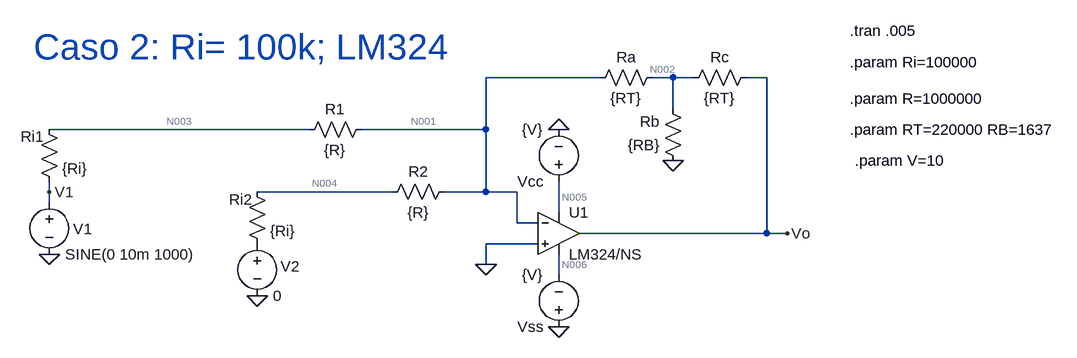
[diagram p0: schematic Caso 1.2 - LM324.asc]
Caso 1.2 - LM324.asc, the LTspice schematic file:
Version 4
SHEET 1 1568 1072
WIRE 560 352 384 352
WIRE 672 352 640 352
WIRE 704 352 672 352
WIRE 816 352 784 352
WIRE 672 400 672 352
WIRE 112 432 -288 432
WIRE 384 432 384 352
WIRE 384 432 192 432
WIRE -288 528 -288 512
WIRE 240 528 32 528
WIRE 384 528 384 432
WIRE 384 528 320 528
WIRE 432 528 384 528
WIRE -288 544 -288 528
WIRE 496 560 496 512
WIRE 432 576 432 528
WIRE 464 576 432 576
WIRE 816 592 816 352
WIRE 816 592 528 592
WIRE 848 592 816 592
WIRE 464 608 384 608
WIRE 384 640 384 608
WIRE 496 656 496 624
FLAG -288 624 0
FLAG 32 688 0
FLAG 384 640 0
FLAG 848 592 Vo
FLAG 496 432 0
FLAG 496 736 0
FLAG 672 480 0
FLAG -288 528 V1
SYMBOL res 208 416 R90
WINDOW 0 0 56 VBottom 2
WINDOW 3 32 56 VTop 2
SYMATTR InstName R1
SYMATTR Value {R}
SYMBOL res 336 512 R90
WINDOW 0 0 56 VBottom 2
WINDOW 3 32 56 VTop 2
SYMATTR InstName R2
SYMATTR Value {R}
SYMBOL voltage -288 528 R0
WINDOW 0 37 57 Left 2
WINDOW 123 0 0 Left 0
WINDOW 39 0 0 Left 0
SYMATTR InstName V1
SYMATTR Value SINE(0 10m 1000)
SYMBOL voltage 32 592 R0
WINDOW 0 36 51 Left 2
WINDOW 123 0 0 Left 0
WINDOW 39 0 0 Left 0
SYMATTR InstName V2
SYMATTR Value 0
SYMBOL voltage 496 752 R180
WINDOW 123 0 0 Left 0
WINDOW 39 0 0 Left 0
SYMATTR InstName Vss
SYMATTR Value {V}
SYMBOL voltage 496 528 R180
WINDOW 123 0 0 Left 0
WINDOW 39 0 0 Left 0
SYMATTR InstName Vcc
SYMATTR Value {V}
SYMBOL res -304 416 R0
WINDOW 0 -28 27 Left 2
SYMATTR InstName Ri1
SYMATTR Value {Ri}
SYMBOL res 16 512 R0
WINDOW 0 -27 28 Left 2
SYMATTR InstName Ri2
SYMATTR Value {Ri}
SYMBOL res 656 336 R90
WINDOW 0 0 56 VBottom 2
WINDOW 3 32 56 VTop 2
SYMATTR InstName Ra
SYMATTR Value {RT}
SYMBOL res 800 336 R90
WINDOW 0 0 56 VBottom 2
WINDOW 3 32 56 VTop 2
SYMATTR InstName Rc
SYMATTR Value {RT}
SYMBOL res 688 496 R180
WINDOW 0 36 76 Left 2
WINDOW 3 36 40 Left 2
SYMATTR InstName Rb
SYMATTR Value {RB}
SYMBOL ZZZ\\OpAmp\\LM324 496 592 R0
SYMATTR InstName U1
TEXT 944 280 Left 2 !.tran .005
TEXT 944 328 Left 2 !.param Ri=100000
TEXT 944 384 Left 2 !.param R=1000000
TEXT 944 432 Left 2 !.param RT=220000 RB=1637
TEXT 952 480 Left 2 !.param V=10
TEXT -312 304 Left 5 ;Caso 2: Ri= 100k; LM324

The netlist it stands for:
* Caso 1.2 - LM324.asc
R1 N001 N003 {R}
R2 N001 N004 {R}
V1 V1 0 SINE(0 10m 1000)
V2 P001 0 0
Vss 0 N006 {V}
Vcc N005 0 {V}
Ri1 N003 V1 {Ri}
Ri2 N004 P001 {Ri}
Ra N002 N001 {RT}
Rc Vo N002 {RT}
Rb 0 N002 {RB}
XU1 0 N001 N005 N006 Vo LM324/NS  ; pins In+ In- V+ V- OUT
.tran .005
.param Ri=100000
.param R=1000000
.param RT=220000 RB=1637
.param V=10
* Caso 2: Ri= 100k; LM324
.backanno
.end

* Results of the author's LTspice run, read from the files saved beside the schematic
* Operating Point, zero values left out:
*   V(n001) = 2.008 mV
*   V(n003) = 182.5 µV
*   V(n004) = 182.5 µV
*   V(n006) = -10 V
*   V(n005) = 10 V
*   V(n002) = -5.536 mV
*   V(vo) = -757.1 mV
*   I(R1) = 1.825 nA
*   I(R2) = 1.825 nA
*   I(Ri1) = 1.825 nA
*   I(Ri2) = 1.825 nA
*   I(Ra) = -34.29 nA
*   I(Rc) = -3.416 µA
*   I(Rb) = 3.382 µA
*   I(V1) = 1.825 nA
*   I(V2) = 1.825 nA
*   I(Vss) = -80.25 µA
*   I(Vcc) = -76.93 µA
*   Ix(u1:1) = -51.97 nA
*   Ix(u1:2) = -37.94 nA
*   Ix(u1:99) = 76.93 µA
*   Ix(u1:50) = -80.25 µA
*   Ix(u1:28) = 3.416 µA
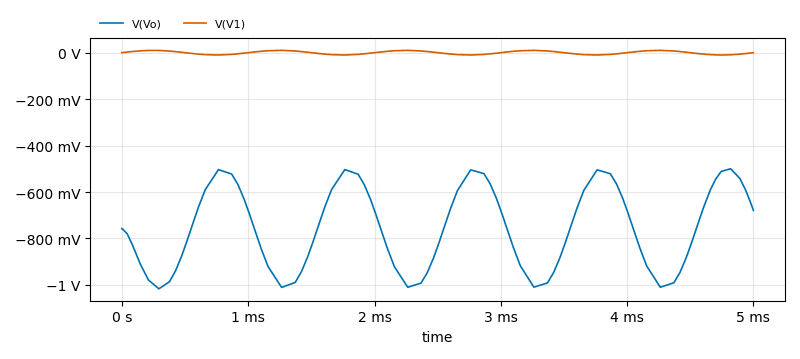
[diagram p1: Transient Analysis of Caso 1.2 - LM324.asc, plotted from the saved traces]
* Transient Analysis, 1 run:
*   V(Vo): min -1.017 V, max -499.7 mV, average -757.8 mV, rms 779.1 mV, last -679.4 mV
*   V(V1): min -9.997 mV, max 9.961 mV, average -6.162 µV, rms 6.952 mV, last 0 V